# EAGLE design micropov (EAGLE 5.10)
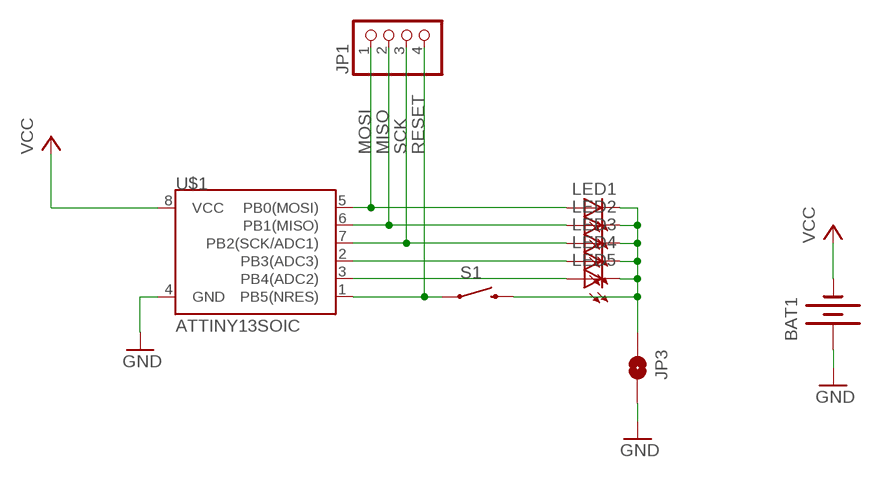
[diagram p0: schematic, sheet 1]

## Parts
BAT1  BATTERY12MM  [BATTCON_12MM]
JP1  PINHD-1X4  [1X04]
JP3  SOLDERJUMPERNO  [SJ_2S-NO]
LED1  LEDSMT1206  [1206]
LED2  LEDSMT1206  [1206]
LED3  LEDSMT1206  [1206]
LED4  LEDSMT1206  [1206]
LED5  LEDSMT1206  [1206]
S1  SWITCH-MOMENTARY-2-SMD-1101NE  [TACTILE-SWITCH-1101NE]
U$1  ATTINY13SOIC  [SO08]

## Nets
GND: BAT1.PWR@1(+) JP3.2 U$1.4(GND)
MISO: JP1.2 LED2.A U$1.6(PB1(MISO))
MOSI: JP1.1 LED1.A U$1.5(PB0(MOSI))
N$4: LED4.A U$1.2(PB3(ADC3))
N$5: LED5.A U$1.3(PB4(ADC2))
N$6: JP3.1 LED1.C LED2.C LED3.C LED4.C LED5.C S1.P$2
RESET: JP1.4 S1.P$1 U$1.1(PB5(NRES))
SCK: JP1.3 LED3.A U$1.7(PB2(SCK/ADC1))
VCC: BAT1.GND(-) U$1.8(VCC)

## Library data of the parts
BAT1 = SparkFun:BATTERY: Battery Holders Various common sizes : AA, AAA, 20mm coin cell and 12mm coin cell.
JP1 = pinhead:PINHD-1X4: PIN HEADER
JP3 = SparkFun:SOLDERJUMPER: Solder Jumper Standard SMD solder jumper. Used to automate production. Two varients : Normally Open and Normally Closed are the same, but have different paste layers. NC will have a large amount of paste and should jumper during reflow.
LED1-LED5 = led:LED: LED OSRAM: - CHIPLED LG R971, LG N971, LY N971, LG Q971, LY Q971, LO R971, LY R971 LH N974, LH R974 LS Q976, LO Q976, LY Q976 LO Q996 - Hyper CHIPLED LW Q18S LB Q993, LB Q99A, LB R99A - SideLED LS A670, LO A670, LY A670, LG A670, LP A670 LB A673, LV A673, LT A673, LW A673 LH A674 LY A675 LS A676, LA A676, LO A676, LY A676, LW A676 LS A679, LY A679, LG A679 - Hyper Micro SIDELED® LS Y876, LA Y876, LO Y876, LY Y876 LT Y87S - SmartLED LW L88C, LW L88S LB L89C, LB L89S, LG L890 LS L89K, LO L89K, LY L89K LS L896, LA L896, LO L896, LY L896 - TOPLED LS T670, LO T670, LY T670, LG T670, LP T670 LSG T670, LSP T670, LSY T670, LOP T670, LYG T670 LG T671, LOG T671, LSG T671 LB T673, LV T673, LT T673, LW T673 LH T674 LS T676, LA T676, LO T676, LY T676, LB T676, LH T676, LSB T676, LW T676 LB T67C, LV T67C, LT T67C, LS T67K, LO T67K, LY T67K, LW E67C LS E67B, LA E67B, LO E67B, LY E67B, LB E67C, LV E67C, LT E67C LW T67C LS T679, LY T679, LG T679 LS T770, LO T770, LY T770, LG T770, LP T770 LB T773, LV T773, LT T773, LW T773 LH T774 LS E675, LA E675, LY E675, LS T675 LS T776, LA T776, LO T776, LY T776, LB T776 LHGB T686 LT T68C, LB T68C - Hyper Mini TOPLED® LB M676 - Mini TOPLED Santana® LG M470 LS M47K, LO M47K, LY M47K Source: http://www.osram.convergy.de LUXEON: - LUMILED® LXK2-PW12-R00, LXK2-PW12-S00, LXK2-PW14-U00, LXK2-PW14-V00 LXK2-PM12-R00, LXK2-PM12-S00, LXK2-PM14-U00 LXK2-PE12-Q00, LXK2-PE12-R00, LXK2-PE12-S00, LXK2-PE14-T00, LXK2-PE14-U00 LXK2-PB12-K00, LXK2-PB12-L00, LXK2-PB12-M00, LXK2-PB14-N00, LXK2-PB14-P00, LXK2-PB14-Q00 LXK2-PR12-L00, LXK2-PR12-M00, LXK2-PR14-Q00, LXK2-PR14-R00 LXK2-PD12-Q00, LXK2-PD12-R00, LXK2-PD12-S00 LXK2-PH12-R00, LXK2-PH12-S00 LXK2-PL12-P00, LXK2-PL12-Q00, LXK2-PL12-R00 Source: www.luxeon.com KINGBRIGHT: KA-3528ASYC Source: www.kingbright.com
S1 = SparkFun:SWITCH-MOMENTARY-2
U$1 = SparkFun:ATTINY13

## Board
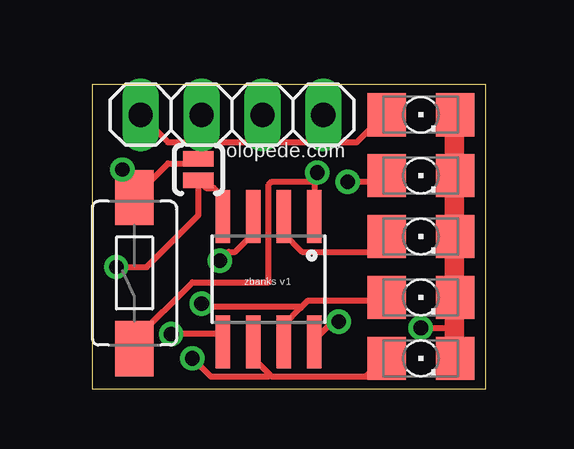
[diagram p1: board, top side]
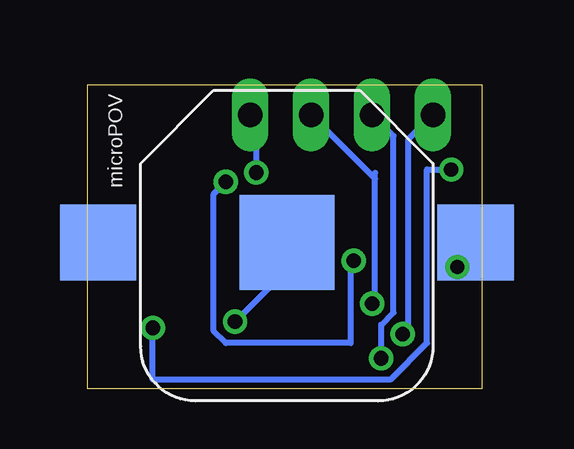
[diagram p2: board, bottom side, seen from below]

Size 16.43 x 12.69 mm. Coordinates in mm from the lower left corner, seen from the top.
Outline: 0,0 16.43,0 16.43,12.69 0,12.69 0,0
Copper layers (1*16): Top 0.035mm / dielectric 1.5mm / Bottom 0.035mm
Design rules "default *": minimum track width 10mil, minimum drill 24mil, track to track 8mil, track to pad 8mil, pad to pad 8mil, via to via 8mil, smd to smd 8mil, copper to edge 20mil, drill to drill 8mil, minimum pad ring 10mil, minimum via ring 8mil, stop-mask expansion 4mil, vias tented up to drill 25mil, thermal gap 10mil

### Footprints (pad centres in the part's own frame; a part is rotated, then mirrored left to right if it is on the bottom)
BATTCON_12MM = smd 3.962 x 3.962: GND 0,0 | smd 3.175 x 3.175: PWR@1 -7.874,0; PWR@2 7.874,0
1X04 = drill 1.016 long: 1 -3.81,0; 2 -1.27,0; 3 1.27,0; 4 3.81,0
SJ_2S-NO = smd 0.635 x 1.27: 1 -0.45,0; 2 0.45,0
1206 = smd 1.6 x 1.803: A -1.422,0; C 1.422,0
TACTILE-SWITCH-1101NE = smd 2.3 x 1.6: P$1 -3.15,0; P$2 3.15,0
SO08 = smd 0.61 x 2.21: 1 -1.905,-2.616; 2 -0.635,-2.616; 3 0.635,-2.616; 4 1.905,-2.616; 5 1.905,2.616; 6 0.635,2.616; 7 -0.635,2.616; 8 -1.905,2.616

### Placement (x,y rotation side)
BAT1  8.13,6.1 180 bottom
JP1  5.84,11.43 0 top
JP3  4.45,9.14 270 top
LED1  13.72,11.43 0 top
LED2  13.72,1.27 0 top
LED3  13.72,3.81 0 top
LED4  13.72,6.35 0 top
LED5  13.72,8.89 0 top
S1  1.78,4.83 90 top
U$1  7.37,4.57 180 top

### Tracks (layer width: path | path; a pad name or v marks a point on that pad's centre or on a via)
GND  (via drill 0.6)
  Top 0.254: v1.02,5.08 2.29,5.08 4.45,7.24 JP3.2 4.76,8.38 5.08,8.38 5.46,8 U$1.4
  Bottom 0.254: BAT1.PWR@1 v1.02,5.08
MISO  (via drill 0.61)
  Top 0.254: 7.43,0.57 6.73,1.27 U$1.6 | 7.43,0.57 7.49,0.51 11.43,0.51 12.19,1.27 LED2.A | v4.19,1.27 4.95,0.51 7.37,0.51 7.43,0.57
  Bottom 0.254: v4.19,1.27 4.19,2.67 3.68,3.17 3.68,10.54 JP1.2
MOSI  (via drill 0.61)
  Top 0.254: LED1.A 12.19,11.43 11.05,10.29 3.17,10.29 JP1.1 | v3.3,2.29 5.21,2.29 5.46,2.03 U$1.5
  Bottom 0.254: v3.3,2.29 3.05,2.54 3.05,10.41 JP1.1
N$4
  Top 0.254: LED4.A 12.19,6.35 11.56,5.71 8.76,5.71 8,6.48 U$1.2
N$5  (via drill 0.61)
  Top 0.254: v10.67,8.64 11.94,8.64 12.19,8.89 LED5.A | v5.33,5.33 5.71,5.71 5.97,5.71 6.73,6.48 U$1.3
  Bottom 0.254: v10.67,8.64 11.18,8.13 11.18,2.41 10.67,1.9 5.46,1.9 5.46,5.21 v5.33,5.33
N$6  (via drill 0.6, 0.61)
  Top 0.254: JP3.1 4.45,9.53 4.32,9.4 3.17,9.4 1.78,8 S1.P$2 1.52,8.23 v1.27,9.14 | 15.11,1.27 LED2.C | 15.11,11.43 LED1.C | 15.11,8.89 LED5.C | 15.11,3.81 LED3.C | 15.11,6.35 LED4.C | v13.72,2.54 15.11,2.54
  Top 0.813: 15.11,1.27 15.11,2.54 15.11,3.81 15.11,6.35 15.11,8.89 15.11,11.43
  Bottom 0.254: v13.72,2.54 13.72,0.38 3.81,0.38 2.29,1.9 2.29,9.14 v1.27,9.14
RESET  (via drill 0.61)
  Top 0.254: 9.27,8.64 7.49,8.64 7.37,8.51 7.37,4.45 4.19,4.45 1.78,2.03 S1.P$1 | 9.27,8.64 U$1.1 | v9.4,9.02 9.4,8.64 9.27,8.64
  Bottom 0.254: JP1.4 9.4,11.18 v9.4,9.02
SCK  (via drill 0.61)
  Top 0.254: 8.7,3.37 8,2.67 U$1.7 | 8.7,3.37 9.02,3.68 12.07,3.68 12.19,3.81 LED3.A | v4.57,3.56 4.7,3.43 8.64,3.43 8.7,3.37
  Bottom 0.254: 4.45,8.76 4.45,3.68 v4.57,3.56 | 4.45,8.76 4.45,9.02 | 4.45,8.76 JP1.3
VCC  (via drill 0.61)
  Top 0.254: v10.29,2.79 10.03,2.79 9.27,2.03 U$1.8
  Bottom 0.254: v10.29,2.79 8.13,4.95 BAT1.GND

### Text on the board
_tsilk: olopede.com | zbanks v1
_bsilk: microPOV